# EAGLE design LiPoChargerBooster5V1A_v10 (EAGLE 9.6.2)
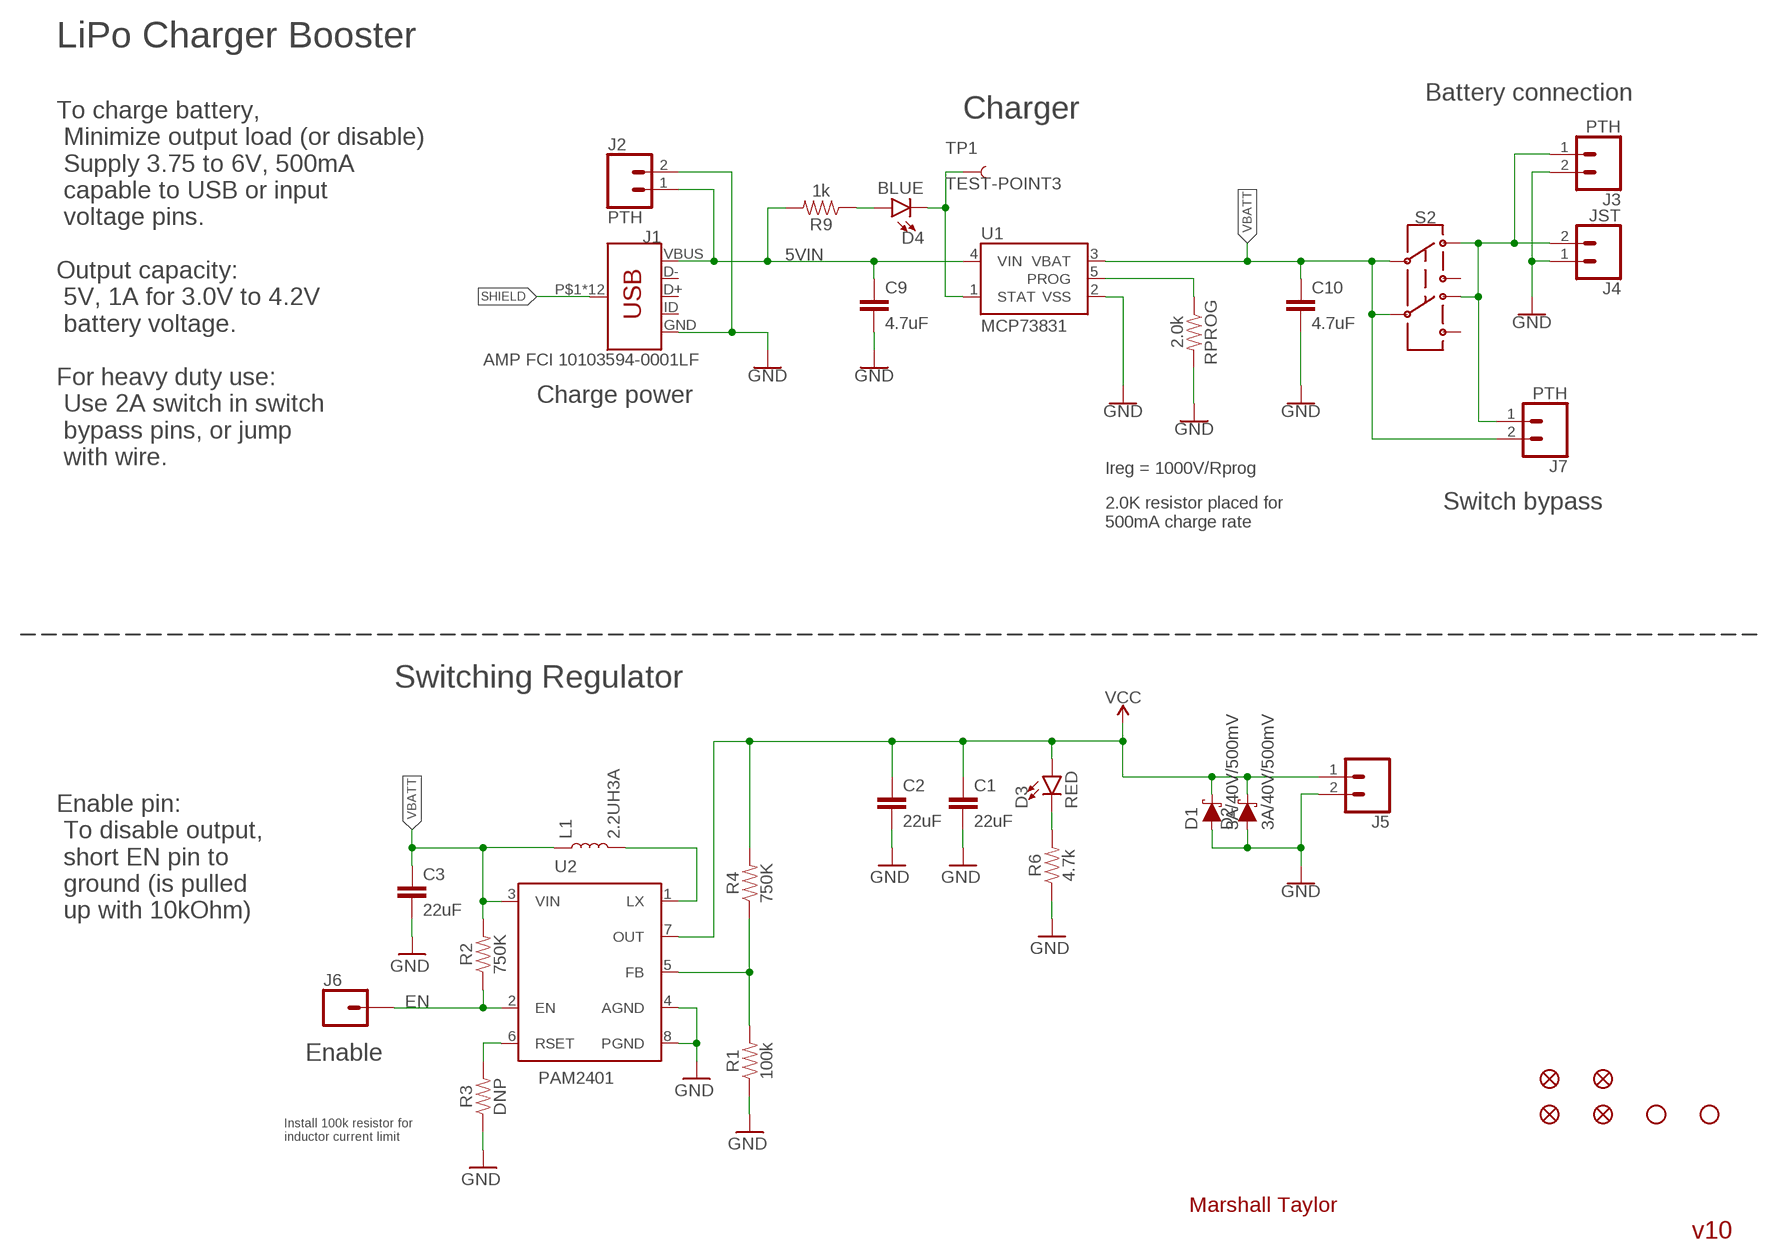
[diagram p0: schematic, sheet 1]

## Parts
C1  22uF  22UF-0805-6.3V-20%  [0805]
C2  22uF  22UF-0805-6.3V-20%  [0805]
C3  22uF  22UF-0805-6.3V-20%  [0805]
C9  4.7uF  4.7UF0603  [0603]
C10  4.7uF  4.7UF0603  [0603]
D1  3A/40V/500mV  DIODE-SCHOTTKY-B340A  [SMA-DIODE]
D2  3A/40V/500mV  DIODE-SCHOTTKY-B340A  [SMA-DIODE]
D3  RED  LED-RED0603  [LED-0603]
D4  BLUE  LED-BLUE0603  [LED-0603]
J1  AMP FCI 10103594-0001LF  USB_MICRO-B_HALF_PTH  [USB-MICROB-PTH]
J2  PTH  CONN_02  [1X02]
J3  PTH  CONN_02  [1X02]
J4  JST  CONN_02-JST-2MM-SMT  [JST-2-SMD]
J5  CONN_02  [1X02]
J6  CONN_01  [1X01]
J7  PTH  CONN_02  [1X02]
JP1  FIDUCIAL1X2  [FIDUCIAL-1X2]
JP2  FIDUCIAL1X2  [FIDUCIAL-1X2]
JP4  FIDUCIAL1X2  [FIDUCIAL-1X2]
JP6  STAND-OFF  [STAND-OFF]
JP7  STAND-OFF  [STAND-OFF]
JP16  FIDUCIAL1X2  [FIDUCIAL-1X2]
L1  2.2UH3A  INDUCTOR-IFSC1515AHER2R2M01  [INDUCTOR_4X4MM]
R1  100k  100KOHM-0603-1/10W-1%  [0603]
R2  750K  750KOHM-0603-1/10W-1%  [0603]
R3  DNP  100KOHM-0603-1/10W-1%  [0603]
R4  750K  750KOHM-0603-1/10W-1%  [0603]
R6  4.7k  4.7KOHM-0603-1/10W-1%  [0603]
R9  1k  1KOHM-0603-1/10W-1%  [0603]
RPROG  2.0k  2.0KOHM-0603-1/10W-5%  [0603]
S2  SWITCH-DPDT-SMD-AYZ0202  [SWITCH_DPDT_SMD_AYZ0202]
TP1  TEST-POINT3  [PAD.03X.03]
U1  MCP73831  [SOT23-5]
U2  PAM2401  [MSOP8]

## Nets
5VIN: C9.1 J1.VBUS J2.1 R9.2 U1.4(VIN)
EN: J6.1 R2.1 U2.2(EN)
GND: C1.2 C2.2 C3.2 C9.2 C10.2 D1.A D2.A J1.GND J2.2 J3.2 J4.1 J5.2 R1.1 R3.1 R6.1 RPROG.2 U1.2(VSS) U2.4(AGND) U2.8(PGND)
N$2: D3.C R6.2
N$3: D4.A R9.1
N$4: L1.P$2 U2.1(LX)
N$6: R3.2 U2.6(RSET)
N$9: J3.1 J4.2 J7.1 S2.1 S2.4
N$11: RPROG.1 U1.5(PROG)
N$12: R1.2 R4.1 U2.5(FB)
N$14: D4.C TP1.P$1 U1.1(STAT)
SHIELD: J1.P$1(SHIELD) J1.P$2(SHIELD) J1.P$3(SHIELD) J1.P$4(SHIELD) J1.P$6(SHIELD) J1.P$8(SHIELD) J1.P$10(SHIELD) J1.P$12(SHIELD) J1.SHEILD2(SHIELD) J1.SHIELD J1.SHIELD3(SHIELD) J1.SHIELD4(SHIELD)
VBATT: C3.1 C10.1 J7.2 L1.P$1 R2.2 S2.2 S2.5 U1.3(VBAT) U2.3(VIN)
VCC: C1.1 C2.1 D1.C D2.C D3.A J5.1 R4.2 U2.7(OUT)
Unconnected: J1.D+ J1.D- J1.ID S2.3 S2.6

## Notes on the sheet
- LiPo Charger Booster
- To charge battery,
   Minimize output load (or disable)
   Supply 3.75 to 6V, 500mA
   capable to USB or input
   voltage pins.
- Battery connection
- Charger
- Output capacity:
   5V, 1A for 3.0V to 4.2V
   battery voltage.
- For heavy duty use:
   Use 2A switch in switch
   bypass pins, or jump
   with wire.
- Charge power
- Ireg = 1000V/Rprog
- Switch bypass
- 2.0K resistor placed for
  500mA charge rate
- Switching Regulator
- Enable pin:
   To disable output,
   short EN pin to
   ground (is pulled
   up with 10kOhm)
- Enable
- Install 100k resistor for
  inductor current limit
- Marshall Taylor
- v10

## Library data of the parts
C1-C3 = SparkFun-Capacitors:22UF: 22µF ceramic capacitors A capacitor is a passive two-terminal electrical component used to store electrical energy temporarily in an electric field.; PROD_ID: CAP-08402
C9 C10 = SparkFun-Capacitors:4.7UF: 4.7µF ceramic capacitors A capacitor is a passive two-terminal electrical component used to store electrical energy temporarily in an electric field.; PROD_ID: CAP-08280
D1 D2 = SparkFun-DiscreteSemi:DIODE-SCHOTTKY: Schottky diode A Schottky diode is a semiconductor diode which has a low forward voltage drop and a very fast switching action.; PROD_ID: DIO-09886
D3 = SparkFun-LED:LED-RED: Red SMD LED Used in manufacturing of most products at SparkFun Packages: 0603 - SMD 0603 package [Product Link] <http://docs.avagotech.com/docs/AV02-0551EN> 0603 SMART - SMD 0603 SMART package ( more efficient and expensive)[Product Link] <http://www.osram-os.com/Graphics/XPic2/00077099_0.pdf> 1206 - SMD1206 package [Product Link] <https://www.sparkfun.com/datasheets/DevTools/LilyPad/Q150OVS4.pdff> SparkFun Products: Pro Mini 328 -5V <https://www.sparkfun.com/products/821> RedBoard <https://www.sparkfun.com/products/12757> IOIO-OTG <https://www.sparkfun.com/products/13613>; PROD_ID: DIO-00819
D4 = SparkFun-LED:LED-BLUE: Blue SMD LED Used in manufacturing of various products at SparkFun Packages: 0603 - SMD 0603 package [Product Link] <http://www.digikey.com/product-detail/en/SMLE12BC7TT86/511-1589-2-ND/1641808> 1206 - SMD1206 package [Product Link] <http://www.digikey.com/product-detail/en/lite-on-inc/LTST-C150TBKT/160-1643-1-ND/573584> SparkFun Products: ESP8266 Thing-Dev Board <https://www.sparkfun.com/products/13711> RedBoard <https://www.sparkfun.com/products/12757>; PROD_ID: DIO-08575
J1 = SparkFun-Connectors:USB_MICRO-B: USB Type Micro-B Connector Male/female and PTH/SMT variants SparkFun Products: SparkFun microB USB Breakout <https://www.sparkfun.com/products/12035> SparkFun USB microB Plug Breakout <https://www.sparkfun.com/products/10031> SparkFun ESP8266 Thing <https://www.sparkfun.com/products/13231>; PROD_ID: CONN-13711
J2 J3 J5 J7 = SparkFun-Connectors:CONN_02: Multi connection point. Often used as Generic Header-pin footprint for 0.1 inch spaced/style header connections On any of the 0.1 inch spaced packages, you can populate with these: Break Away Headers - Straight <https://www.sparkfun.com/products/116> (PRT-00116) Break Away Male Headers - Right Angle <https://www.sparkfun.com/products/553> (PRT-00553) Female Headers <https://www.sparkfun.com/products/115> (PRT-00115) Break Away Headers - Machine Pin <https://www.sparkfun.com/products/117> (PRT-00117) Break Away Female Headers - Swiss Machine Pin <https://www.sparkfun.com/products/743> (PRT-00743) For SCREWTERMINALS and SPRING TERMINALS visit here: Screw Terimnals on SparkFun.com <https://www.sparkfun.com/search/results?term=Screw+Terminals> (5mm/3.5mm/2.54mm spacing) This device is also useful as a general connection point to wire up your design to another part of your project. Our various solder wires solder well into these plated through hole pads. Hook-Up Wire - Assortment (Stranded, 22 AWG) <https://www.sparkfun.com/products/11375> (PRT-11375) Hook-Up Wire - Assortment (Solid Core, 22 AWG) <https://www.sparkfun.com/products/11367> (PRT-11367) View the entire wire category on our website here <https://www.sparkfun.com/categories/141> Special notes: Molex polarized connector foot print use with: PRT-08233 with associated crimp pins and housings. 2.54_SCREWTERM for use with PRT-10571. 3.5mm Screw Terminal footprints for PRT-08084 5mm Screw Terminal footprints for use with PRT-08432
J4 = SparkFun-Connectors:CONN_02: Multi connection point. Often used as Generic Header-pin footprint for 0.1 inch spaced/style header connections On any of the 0.1 inch spaced packages, you can populate with these: Break Away Headers - Straight <https://www.sparkfun.com/products/116> (PRT-00116) Break Away Male Headers - Right Angle <https://www.sparkfun.com/products/553> (PRT-00553) Female Headers <https://www.sparkfun.com/products/115> (PRT-00115) Break Away Headers - Machine Pin <https://www.sparkfun.com/products/117> (PRT-00117) Break Away Female Headers - Swiss Machine Pin <https://www.sparkfun.com/products/743> (PRT-00743) For SCREWTERMINALS and SPRING TERMINALS visit here: Screw Terimnals on SparkFun.com <https://www.sparkfun.com/search/results?term=Screw+Terminals> (5mm/3.5mm/2.54mm spacing) This device is also useful as a general connection point to wire up your design to another part of your project. Our various solder wires solder well into these plated through hole pads. Hook-Up Wire - Assortment (Stranded, 22 AWG) <https://www.sparkfun.com/products/11375> (PRT-11375) Hook-Up Wire - Assortment (Solid Core, 22 AWG) <https://www.sparkfun.com/products/11367> (PRT-11367) View the entire wire category on our website here <https://www.sparkfun.com/categories/141> Special notes: Molex polarized connector foot print use with: PRT-08233 with associated crimp pins and housings. 2.54_SCREWTERM for use with PRT-10571. 3.5mm Screw Terminal footprints for PRT-08084 5mm Screw Terminal footprints for use with PRT-08432; PROD_ID: CONN-11443
J6 = SparkFun-Connectors:CONN_01: Single connection point. Often used as Generic Header-pin footprint for 0.1 inch spaced/style header connections On any of the 0.1 inch spaced packages, you can populate with these: Break Away Headers - Straight <https://www.sparkfun.com/products/116> (PRT-00116) Break Away Male Headers - Right Angle <https://www.sparkfun.com/products/553> (PRT-00553) Female Headers <https://www.sparkfun.com/products/115> (PRT-00115) Break Away Headers - Machine Pin <https://www.sparkfun.com/products/117> (PRT-00117) Break Away Female Headers - Swiss Machine Pin <https://www.sparkfun.com/products/743> (PRT-00743) This device is also useful as a general connection point to wire up your design to another part of your project. Our various solder wires solder well into these plated through hole pads. Hook-Up Wire - Assortment (Stranded, 22 AWG) <https://www.sparkfun.com/products/11375> (PRT-11375) Hook-Up Wire - Assortment (Solid Core, 22 AWG) <https://www.sparkfun.com/products/11367> (PRT-11367) View the entire wire category on our website here <https://www.sparkfun.com/categories/141> Special notes: SMTSO-256-ET is a "flush mount" nut for a 4-40 screw. We mostly use this on specialty testbeds; it is a nice way to connect hardware to your PCB at an adjustable hieght. Also note, the SNAP packages are for using a snappable style connector. We sell a baggie of snaps and they are also used on two LilyPad designs: Snap Assortment - 30 pack (male and female) <https://www.sparkfun.com/products/11347> (DEV-11347) LilyPad Arduino SimpleSnap <https://www.sparkfun.com/products/10941> (DEV-10941) LilyPad SimpleSnap Protoboard <https://www.sparkfun.com/products/10940> (DEV-10940)
JP1 JP2 JP4 JP16 = SparkFun-Aesthetics:FIDUCIAL: Fiducial Alignment Points Point-of-reference for pick-and-place machines and other optical instruments.
JP6 JP7 = SparkFun:STAND-OFF: Stand Off This is the mechanical footprint for a #4 phillips button head screw. Use the keepout ring to avoid running the screw head into surrounding components. SKU : PRT-00447
L1 = SparkFun-Coils:INDUCTOR: Inductors Resist changes in electrical current. Basically a coil of wire. SparkFun Products: SparkFun Load Cell Amplifier - HX711 <https://www.sparkfun.com/products/13879> IOIO-OTG - V2.2 <https://www.sparkfun.com/products/13613>; PROD_ID: NDUC-13770
R1 = SparkFun-Resistors:100KOHM: 100kΩ resistor A resistor is a passive two-terminal electrical component that implements electrical resistance as a circuit element. Resistors act to reduce current flow, and, at the same time, act to lower voltage levels within circuits. - Wikipedia; PROD_ID: RES-07828
R2 R4 = SparkFun-Resistors:750KOHM: 750Ω resistor A resistor is a passive two-terminal electrical component that implements electrical resistance as a circuit element. Resistors act to reduce current flow, and, at the same time, act to lower voltage levels within circuits. - Wikipedia; PROD_ID: RES-13768
R3 = SparkFun-Resistors:100KOHM: 100kΩ resistor A resistor is a passive two-terminal electrical component that implements electrical resistance as a circuit element. Resistors act to reduce current flow, and, at the same time, act to lower voltage levels within circuits. - Wikipedia; PROD_ID: RES-07828; VALUE: 100k
R6 = SparkFun-Resistors:4.7KOHM: 4.7kΩ resistor A resistor is a passive two-terminal electrical component that implements electrical resistance as a circuit element. Resistors act to reduce current flow, and, at the same time, act to lower voltage levels within circuits. - Wikipedia; PROD_ID: RES-07857
R9 = SparkFun-Resistors:1KOHM: 1kΩ resistor A resistor is a passive two-terminal electrical component that implements electrical resistance as a circuit element. Resistors act to reduce current flow, and, at the same time, act to lower voltage levels within circuits. - Wikipedia; PROD_ID: RES-07856
RPROG = SparkFun-Resistors:2.0KOHM: 2kΩ resistor A resistor is a passive two-terminal electrical component that implements electrical resistance as a circuit element. Resistors act to reduce current flow, and, at the same time, act to lower voltage levels within circuits. - Wikipedia; PROD_ID: RES-08296
S2 = SparkFun-Switches:SWITCH-DPDT: Double-Pole, Double-Throw (DPDT) Switch Double-pole, double-throw switches. Variant Overview PTH-GPI-152-3013 Used on SparkFun Geiger Counter <https://www.sparkfun.com/products/11345> SMD-AY0202 Surface Mount DPDT Switch <https://www.sparkfun.com/products/597> (COM-00597) Used on e.g. LilyPad Arduino USB - ATmega32U4 Board <https://www.sparkfun.com/products/12049>; PROD_ID: SWCH-08179; SF_SKU: COM-00597
TP1 = SparkFun-Connectors:TEST-POINT: SparkFun Test Points Bare copper test points for troubleshooting or In-Circuit-Testing. These are used by our Production team for verifying production board runs using pogo-pins on test beds. SparkFun Products: SparkFun LSM9DS1 Breakout <https://www.sparkfun.com/products/13284> SparkFun PSOC <https://www.sparkfun.com/products/13714> SparkFun Load Cell Amplifier <https://www.sparkfun.com/products/13879>
U1 = SparkFun-IC-Power:MCP73831: MCP73831T Li-Ion, Li-Pol Controller Miniature single cell, fully integrated Li-Ion, Li-polymer charge management controller Datasheet <http://ww1.microchip.com/downloads/en/DeviceDoc/20001984g.pdf> SparkFun Products: SparkFun ESP32 Thing <https://www.sparkfun.com/products/13907> SparkFun 9DoF Razor IMU M0 <https://www.sparkfun.com/products/14001>; PROD_ID: IC-09995
U2 = SparkFun-IC-Power:PAM2401: PAM2401 - Boost PMIC Specifications: Up to 1A output current 0.9V to 4.75V Input Range 2.5V to 5.0V Adjustable Output Voltage Datasheet <https://www.diodes.com/assets/Datasheets/PAM2401.pdf> (Diodes inc.); PROD_ID: IC-13769

## Net classes
0 default: width 0.152 mm, drill 0.305 mm, clearance 0.152 mm

## Board
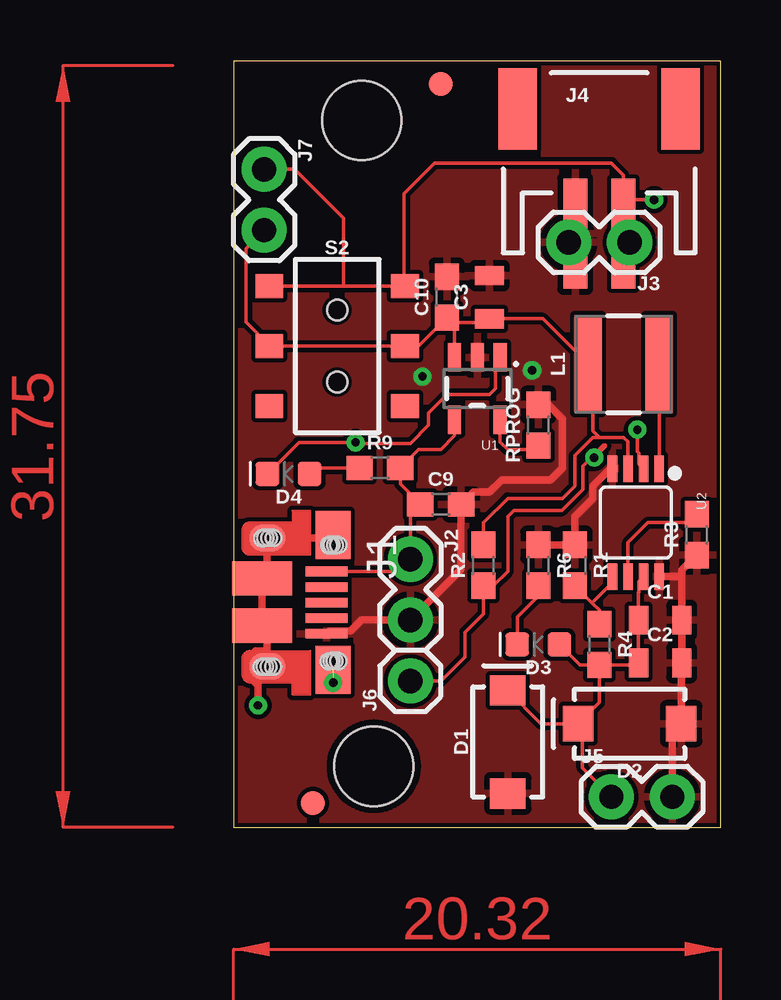
[diagram p1: board, top side]
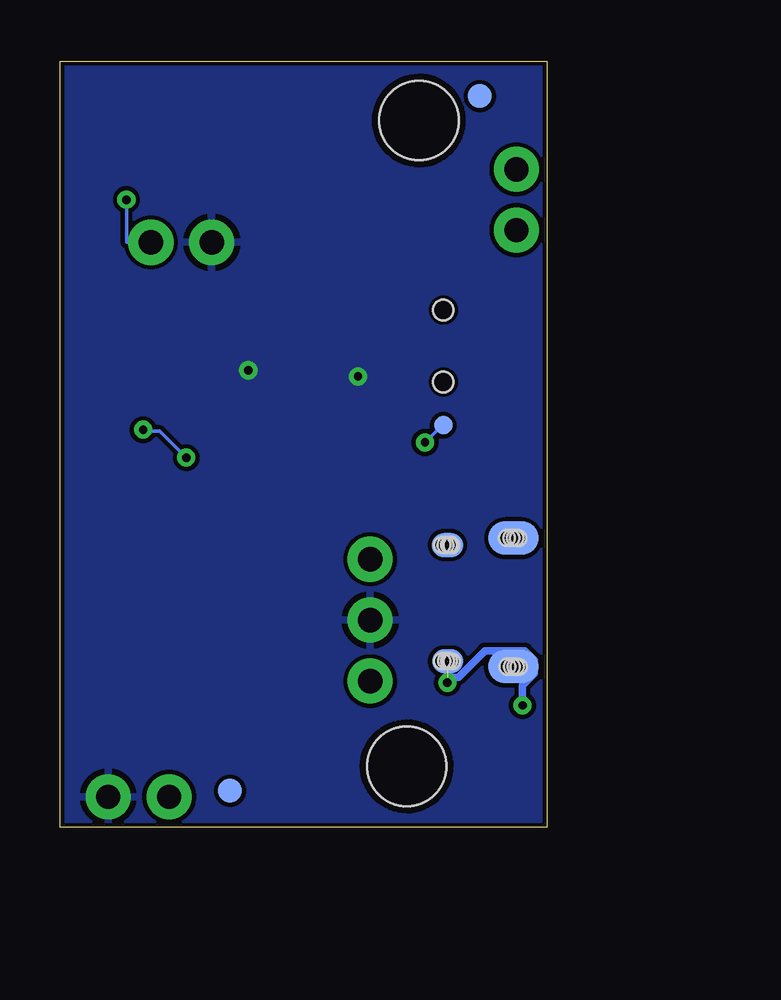
[diagram p2: board, bottom side, seen from below]

Size 20.3 x 31.93 mm. Coordinates in mm from the lower left corner, seen from the top.
Outline: 0,0 20.3,0 20.3,31.93 0,31.93 0,0
Copper layers (1*16): Top 0.035mm / dielectric 1.5mm / Bottom 0.035mm
Design rules "default *": minimum track width 6mil, minimum drill 0.35mm, track to track 7mil, track to pad 7mil, pad to pad 7mil, via to via 7mil, smd to smd 7mil, copper to edge 7mil, drill to drill 7mil, minimum pad ring 10mil, minimum via ring 8mil, stop-mask expansion 4mil, vias tented up to drill 0mil, thermal gap 10mil

### Footprints (pad centres in the part's own frame; a part is rotated, then mirrored left to right if it is on the bottom)
0805 = smd 0.8 x 1.2: 1 -0.9,0; 2 0.9,0
0603 = smd 1.1 x 1: 1 -0.85,0; 2 0.85,0
SMA-DIODE = smd 1.27 x 1.47: A -2.15,0; C 2.15,0
LED-0603 = smd 1 x 1: A -0.877,0; C 0.877,0
USB-MICROB-PTH = smd 0.4 x 1.75: D+ 0.031,1.331; D- -0.619,1.331; GND 1.331,1.331; ID 0.681,1.331; VBUS -1.269,1.331 | smd 1.4 x 2.1 bottom: P$1 2.701,-1.142; P$3 -2.659,-1.144 | smd 1 x 1.3: P$2 2.487,1.594; P$6 -2.368,1.604 | smd 1 x 1.3 bottom: P$4 -2.368,1.604; P$10 2.481,1.598 | smd 1.1 x 1.5: P$8 2.701,-1.142; P$12 -2.659,-1.144 | smd 2 x 1.46: SHEILD2 2.831,1.606; SHIELD -2.794,1.606 | smd 1.425 x 2.5: SHIELD3 -0.979,-1.349; SHIELD4 0.996,-1.352 | hole 0.66: -2.659,-0.879; 2.477,1.821; 2.461,1.666; 2.481,1.426; 2.467,1.536; -2.659,-1.059; -2.659,-1.219; -2.649,-1.349; 2.701,-0.899; 2.701,-1.079; 2.701,-1.239; 2.711,-1.369; -2.369,1.821; -2.359,1.691; -2.369,1.541; -2.364,1.432
1X02 = drill 1.016 pad 1.88: 1 0,0; 2 2.54,0
JST-2-SMD = smd 1 x 4.6: 1 -1,-3.7; 2 1,-3.7 | smd 1.6 x 3.4: NC1 -3.4,1.5; NC2 3.4,1.5
1X01 = drill 1.016 pad 1.88: 1 0,0
FIDUCIAL-1X2 = smd 1 x 1: 1 0,0
STAND-OFF = hole 3.302: 0,0
INDUCTOR_4X4MM = smd 4.089 x 1.143: P$1 0,1.473; P$2 0,-1.473
SWITCH_DPDT_SMD_AYZ0202 = smd 1 x 1.15: 1 -2.5,2.825; 2 0,2.825; 3 2.5,2.825; 4 -2.5,-2.825; 5 0,-2.825; 6 2.5,-2.825 | hole 0.85: 1.5,0; -1.5,0
PAD.03X.03 = smd 0.762 x 0.762: P$1 0,0
SOT23-5 = smd 0.55 x 1.2: 1 -0.95,-1.3; 2 0,-1.3; 3 0.95,-1.3; 4 0.95,1.3; 5 -0.95,1.3
MSOP8 = smd 0.4 x 1.1: 1 -0.975,-2.25; 2 -0.325,-2.25; 3 0.325,-2.25; 4 0.975,-2.25; 5 0.975,2.25; 6 0.325,2.25; 7 -0.325,2.25; 8 -0.975,2.25

### Placement (x,y rotation side)
C1  17.78,8.64 0 top
C2  17.78,6.86 0 top
C3  10.67,22.1 90 top
C9  8.64,13.46 0 top
C10  8.89,22.1 90 top
D1  11.43,3.56 90 top
D2  16.51,4.32 180 top
D3  12.7,7.62 180 top
D4  2.29,14.73 180 top
J1  2.54,9.4 270 top
J2  7.37,11.18 270 top
J3  16.51,24.38 180 top
J4  15.24,28.45 0 top
J5  15.75,1.27 0 top
J6  7.37,6.1 90 top
J7  1.27,27.43 270 top
JP1  2.79,30.48 0 bottom
JP2  3.3,1.02 0 top
JP4  13.21,1.52 0 bottom
JP6  5.84,2.54 0 top
JP7  5.33,29.46 0 top
JP16  8.64,30.99 0 top
L1  16.26,19.3 90 top
R1  14.22,10.92 270 top
R2  10.41,10.92 90 top
R3  19.3,12.19 90 top
R4  15.24,7.62 270 top
R6  12.7,10.92 270 top
R9  6.1,14.99 0 top
RPROG  12.7,16.76 90 top
S2  4.32,20.07 270 top
TP1  4.32,16.76 0 bottom
U1  10.16,18.29 180 top
U2  16.76,12.7 180 top

### Tracks (layer width: path | path; a pad name or v marks a point on that pad's centre or on a via)
5VIN
  Top 0.152: C9.1 6.95,14.3 R9.2 7.71,15.75 8.64,15.75 9.21,16.32 U1.4 | J1.VBUS 5.59,10.67 6.86,10.67 J2.1 7.37,13.04 7.7,13.38
  Top 0.305: C9.1 7.7,13.38
EN  (via drill 0.35)
  Top 0.152: J6.1 8.64,6.1 9.65,7.11 9.65,8.13 10.41,8.89 R2.1 10.83,10.07 11.43,10.67 11.43,12.95 11.68,13.21 13.68,13.21 14.55,14.09 14.55,15.06 15.42,15.93 15.49,15.93 15.49,15.87 v15.03,15.41 | v16.83,16.58 16.83,15.67 16.89,15.61 16.89,15.15 U2.2
  Bottom 0.152: v15.03,15.41 16.13,16.51 16.76,16.51 v16.83,16.58
GND  (via drill 0.35)
  Top 0.152: J4.1 14.22,24.76 14.22,26.67
  Top 0.305: R6.1 R1.1 14.22,12.95 14.99,13.72 14.99,14.22 15.71,14.95 U2.4 | J1.GND 3.99,8.19 4.88,8.19 5.33,8.64 J2.2 9.49,10.76 C9.2 9.99,13.97 10.67,13.97 11.18,14.48 13.21,14.48 13.72,14.99 13.72,17.02 13.12,17.61 RPROG.2 | J5.2 18.29,3.95 D2.A 18.66,6.84 C2.2 C1.2 18.68,10.41 | 18.68,10.41 18.68,10.72 R3.1 | U2.8 18.64,10.45 18.68,10.41
  other vias: 7.87,18.8 12.45,19.05
  pour Bottom: -1.78,33.27 21.84,33.27 21.84,-2.79 -1.78,-2.79 -1.78,-2.54
  pour Top: -1.02,34.04 21.34,34.04 21.34,-1.78 -1.02,-1.78 -1.02,-1.52
  pour Bottom: -1.52,33.53 21.59,33.53 21.59,-3.3 -1.52,-3.3
N$2
  Top 0.152: R6.2 12.7,9.65 11.82,8.78 D3.C
N$3
  Top 0.152: D4.A 3.42,14.99 R9.1
N$4
  Top 0.152: L1.P$2 U2.1
N$6
  Top 0.152: U2.6 16.44,11.87 17.27,12.7 18.96,12.7 R3.2
N$9  (via drill 0.35)
  Top 0.152: S2.4 4.57,22.57 | 4.57,22.57 7.11,22.57 | 7.11,22.57 S2.1 | J7.1 2.54,27.43 4.57,25.4 4.57,22.57 | 16,26.42 16.24,26.18 J4.2 16.24,26.16 | 16.24,26.16 16.24,27.19 15.75,27.69 8.38,27.69 7.11,26.42 7.11,22.57 | v17.53,26.16 16.24,26.16
  Bottom 0.152: J3.1 17.53,24.38 v17.53,26.16
N$11
  Top 0.152: U1.5 11.11,16.07 11.43,15.75 12.53,15.75 RPROG.1
N$12
  Top 0.152: R1.2 14.94,9.35 | 14.94,9.35 15.24,9.06 R4.1 | U2.5 15.79,10.2 14.94,9.35
N$14  (via drill 0.35)
  Top 0.152: U1.1 10.92,19.4 10.92,18.29 10.67,18.03 8.89,18.03 8.13,17.27 8.13,16.76 7.37,16 5.08,16 v5.08,16.04 2.72,16.04 D4.C
  Bottom 0.152: v5.08,16.04 4.36,16.76 TP1.P$1
SHIELD  (via drill 0.35)  (5 unrouted)
  Top 0.305: v4.15,6.03 4.15,6.26 | J1.P$8 1.02,6.32 v1.02,5.08 1.02,5.91 0.51,6.41 0.51,6.96 0.91,7.36 1.4,7.36 1.4,8.19 J1.SHIELD4 J1.SHIELD3 1.4,10.58 J1.P$12 3.85,12.06 J1.P$6 J1.SHIELD | J1.SHEILD2 4.13,6.58 J1.P$2
  Bottom 0.305: v1.02,5.08 1.02,5.91 0.51,6.41 0.51,6.96 0.91,7.36 2.59,7.36 3.69,6.26 4.14,6.26 4.15,6.25 v4.15,6.03
VBATT
  Top 0.152: 15.24,16.26 14.99,16.51 14.99,19.1 L1.P$1 12.89,21.2 C3.1 10.51,21.04 9.1,21.04 | 15.24,16.26 16.26,16.26 16.44,16.07 U2.3 | R2.2 10.41,12.7 11.43,13.72 13.72,13.72 14.22,14.22 14.22,15.49 14.99,16.26 15.24,16.26 | J7.2 0.51,24.13 0.51,21.05 S2.5 S2.2 7.71,20.07 C10.1 9.1,21.04 | 9.1,21.04 9.21,20.93 U1.3
VCC
  Top 0.152: D1.C 12.82,4.32 D2.C 14.55,4.5 | D3.A 14.43,6.77 R4.2 | R4.2 16.79,6.77 C2.1 C1.1 16.88,9.78 16.89,9.79 16.89,10.25 U2.7 | 14.55,4.5 15.24,5.2 R4.2 | J5.1 14.55,2.47 14.55,4.5
(copper drawn outside any net)
  shapes: Top area x2